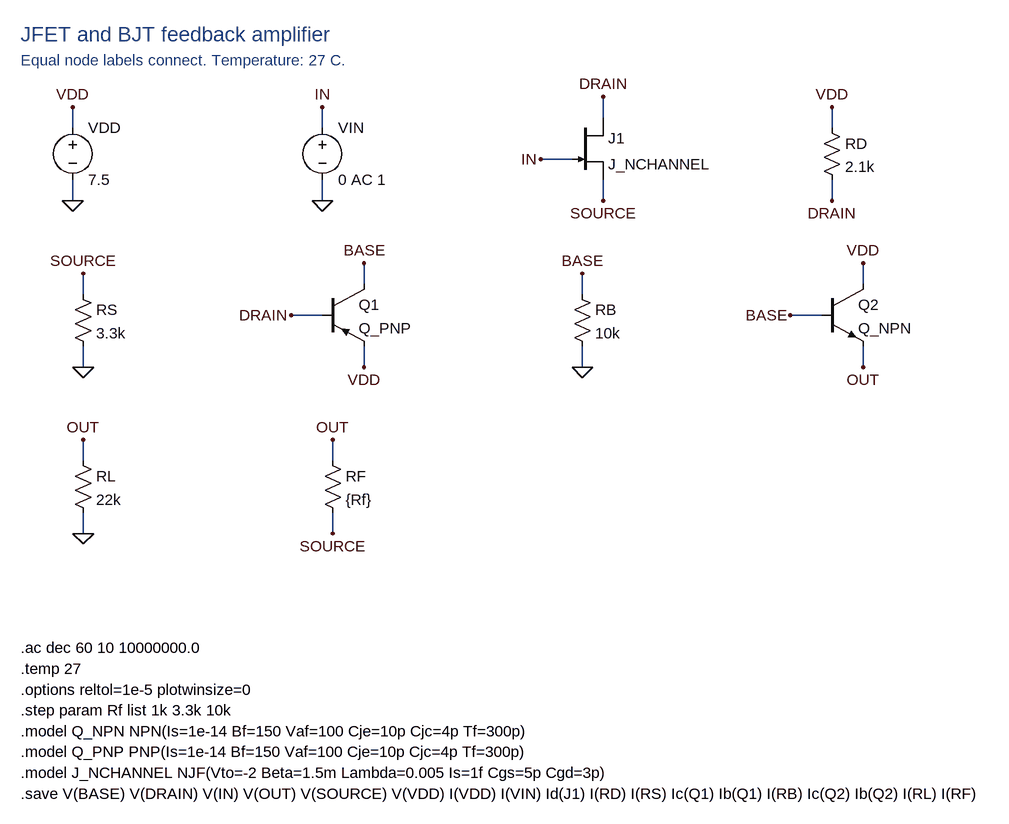
[diagram p0: schematic jfet-bjt-feedback.asc]
jfet-bjt-feedback.asc, the LTspice schematic file:
Version 4
SHEET 1 1740 1352
WIRE 144 176 144 144
WIRE 144 256 144 288
WIRE 528 176 528 144
WIRE 528 256 528 288
WIRE 960 160 960 128
WIRE 912 224 864 224
WIRE 960 256 960 288
WIRE 1312 176 1312 144
WIRE 1312 256 1312 288
WIRE 160 432 160 400
WIRE 160 512 160 544
WIRE 592 416 592 384
WIRE 528 464 480 464
WIRE 592 512 592 544
WIRE 928 432 928 400
WIRE 928 512 928 544
WIRE 1360 416 1360 384
WIRE 1296 464 1248 464
WIRE 1360 512 1360 544
WIRE 160 688 160 656
WIRE 160 768 160 800
WIRE 544 688 544 656
WIRE 544 768 544 800
FLAG 144 144 VDD
FLAG 144 288 0
FLAG 528 144 IN
FLAG 528 288 0
FLAG 960 128 DRAIN
FLAG 864 224 IN
FLAG 960 288 SOURCE
FLAG 1312 144 VDD
FLAG 1312 288 DRAIN
FLAG 160 400 SOURCE
FLAG 160 544 0
FLAG 592 384 BASE
FLAG 480 464 DRAIN
FLAG 592 544 VDD
FLAG 928 400 BASE
FLAG 928 544 0
FLAG 1360 384 VDD
FLAG 1248 464 BASE
FLAG 1360 544 OUT
FLAG 160 656 OUT
FLAG 160 800 0
FLAG 544 656 OUT
FLAG 544 800 SOURCE
SYMBOL voltage 144 160 R0
SYMATTR InstName VDD
SYMATTR Value 7.5
SYMBOL voltage 528 160 R0
SYMATTR InstName VIN
SYMATTR Value 0 AC 1
SYMBOL njf 912 160 R0
SYMATTR InstName J1
SYMATTR Value J_NCHANNEL
SYMBOL res 1296 160 R0
SYMATTR InstName RD
SYMATTR Value 2.1k
SYMBOL res 144 416 R0
SYMATTR InstName RS
SYMATTR Value 3.3k
SYMBOL pnp 528 416 R0
SYMATTR InstName Q1
SYMATTR Value Q_PNP
SYMBOL res 912 416 R0
SYMATTR InstName RB
SYMATTR Value 10k
SYMBOL npn 1296 416 R0
SYMATTR InstName Q2
SYMATTR Value Q_NPN
SYMBOL res 144 672 R0
SYMATTR InstName RL
SYMATTR Value 22k
SYMBOL res 528 672 R0
SYMATTR InstName RF
SYMATTR Value {Rf}
TEXT 64 32 Left 3 ;JFET and BJT feedback amplifier
TEXT 64 72 Left 2 ;Equal node labels connect. Temperature: 27 C.
TEXT 64 976 Left 2 !.ac dec 60 10 10000000.0
TEXT 64 1008 Left 2 !.temp 27
TEXT 64 1040 Left 2 !.options reltol=1e-5 plotwinsize=0
TEXT 64 1072 Left 2 !.step param Rf list 1k 3.3k 10k
TEXT 64 1104 Left 2 !.model Q_NPN NPN(Is=1e-14 Bf=150 Vaf=100 Cje=10p Cjc=4p Tf=300p)
TEXT 64 1136 Left 2 !.model Q_PNP PNP(Is=1e-14 Bf=150 Vaf=100 Cje=10p Cjc=4p Tf=300p)
TEXT 64 1168 Left 2 !.model J_NCHANNEL NJF(Vto=-2 Beta=1.5m Lambda=0.005 Is=1f Cgs=5p Cgd=3p)
TEXT 64 1200 Left 2 !.save V(BASE) V(DRAIN) V(IN) V(OUT) V(SOURCE) V(VDD) I(VDD) I(VIN) Id(J1) I(RD) I(RS) Ic(Q1) Ib(Q1) I(RB) Ic(Q2) Ib(Q2) I(RL) I(RF)

The netlist it stands for:
* jfet-bjt-feedback.asc
VDD VDD 0 7.5
VIN IN 0 0 AC 1
J1 DRAIN IN SOURCE J_NCHANNEL
RD VDD DRAIN 2.1k
RS SOURCE 0 3.3k
Q1 BASE DRAIN VDD 0 Q_PNP
RB BASE 0 10k
Q2 VDD BASE OUT 0 Q_NPN
RL OUT 0 22k
RF OUT SOURCE {Rf}
.model NPN NPN
.model PNP PNP
.lib standard.bjt
.model NJF NJF
.model PJF PJF
.lib standard.jft
* JFET and BJT feedback amplifier
* Equal node labels connect. Temperature: 27 C.
.ac dec 60 10 10000000.0
.temp 27
.options reltol=1e-5 plotwinsize=0
.step param Rf list 1k 3.3k 10k
.model Q_NPN NPN(Is=1e-14 Bf=150 Vaf=100 Cje=10p Cjc=4p Tf=300p)
.model Q_PNP PNP(Is=1e-14 Bf=150 Vaf=100 Cje=10p Cjc=4p Tf=300p)
.model J_NCHANNEL NJF(Vto=-2 Beta=1.5m Lambda=0.005 Is=1f Cgs=5p Cgd=3p)
.save V(BASE) V(DRAIN) V(IN) V(OUT) V(SOURCE) V(VDD) I(VDD) I(VIN) Id(J1) I(RD) I(RS) Ic(Q1) Ib(Q1) I(RB) Ic(Q2) Ib(Q2) I(RL) I(RF)
.backanno
.end